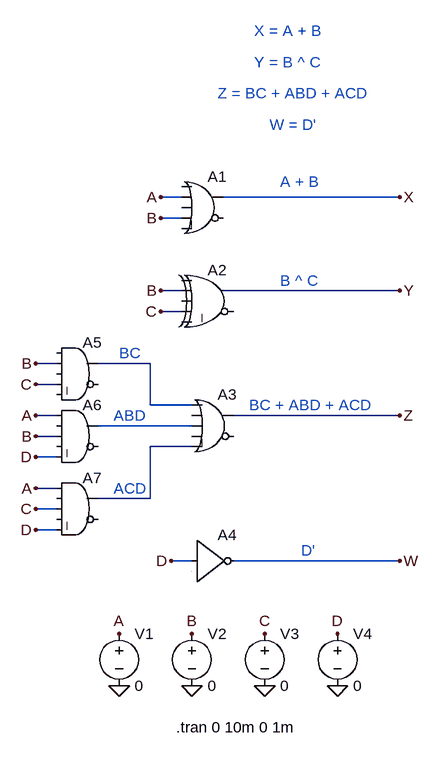
[diagram p0: schematic Exercise3.asc]
Exercise3.asc, the LTspice schematic file:
Version 4
SHEET 1 880 784
WIRE 208 -48 176 -48
WIRE 544 -48 272 -48
WIRE 208 -16 176 -16
WIRE 208 96 176 96
WIRE 544 96 272 96
WIRE 208 128 176 128
WIRE 16 208 -16 208
WIRE 160 208 80 208
WIRE 16 240 -16 240
WIRE 160 272 160 208
WIRE 224 272 160 272
WIRE 16 288 -16 288
WIRE 544 288 288 288
WIRE 224 304 80 304
WIRE 16 320 -16 320
WIRE 224 336 160 336
WIRE 16 352 -16 352
WIRE 16 400 -16 400
WIRE 160 416 160 336
WIRE 160 416 80 416
WIRE 16 432 -16 432
WIRE 16 464 -16 464
WIRE 224 512 192 512
WIRE 544 512 288 512
FLAG 112 704 0
FLAG 224 704 0
FLAG 336 704 0
FLAG 448 704 0
FLAG 112 624 A
FLAG 224 624 B
FLAG 336 624 C
FLAG 448 624 D
FLAG 176 -48 A
FLAG 176 -16 B
FLAG 176 96 B
FLAG 176 128 C
FLAG -16 208 B
FLAG -16 240 C
FLAG -16 288 A
FLAG -16 320 B
FLAG -16 352 D
FLAG -16 400 A
FLAG -16 464 D
FLAG -16 432 C
FLAG 192 512 D
FLAG 544 -48 X
FLAG 544 96 Y
FLAG 544 288 Z
FLAG 544 512 W
SYMBOL Digital\\xor 256 48 R0
SYMATTR InstName A2
SYMATTR SpiceLine vhigh=5V
SYMBOL Digital\\or 256 240 R0
SYMATTR InstName A3
SYMATTR SpiceLine vhigh=5V
SYMBOL Digital\\inv 224 448 R0
SYMATTR InstName A4
SYMATTR SpiceLine vhigh=5V
SYMBOL voltage 112 608 R0
WINDOW 123 0 0 Left 0
WINDOW 39 0 0 Left 0
SYMATTR InstName V1
SYMATTR Value 0
SYMBOL voltage 224 608 R0
WINDOW 123 0 0 Left 0
WINDOW 39 0 0 Left 0
SYMATTR InstName V2
SYMATTR Value 0
SYMBOL voltage 336 608 R0
WINDOW 123 0 0 Left 0
WINDOW 39 0 0 Left 0
SYMATTR InstName V3
SYMATTR Value 0
SYMBOL voltage 448 608 R0
WINDOW 123 0 0 Left 0
WINDOW 39 0 0 Left 0
SYMATTR InstName V4
SYMATTR Value 0
SYMBOL Digital\\and 48 160 R0
SYMATTR InstName A5
SYMATTR SpiceLine vhigh=5V
SYMBOL Digital\\and 48 256 R0
SYMATTR InstName A6
SYMATTR SpiceLine vhigh=5V
SYMBOL Digital\\and 48 368 R0
SYMATTR InstName A7
SYMATTR SpiceLine vhigh=5V
SYMBOL Digital\\or 240 -96 R0
SYMATTR InstName A1
SYMATTR SpiceLine vhigh=5V
TEXT 360 -72 Left 2 ;A + B
TEXT 360 80 Left 2 ;B ^ C
TEXT 392 496 Left 2 ;D'
TEXT 112 192 Left 2 ;BC
TEXT 104 288 Left 2 ;ABD
TEXT 104 400 Left 2 ;ACD
TEXT 312 272 Left 2 ;BC + ABD + ACD
TEXT 200 768 Left 2 !.tran 0 10m 0 1m
TEXT 320 -304 Left 2 ;X = A + B
TEXT 320 -256 Left 2 ;Y = B ^ C
TEXT 264 -208 Left 2 ;Z = BC + ABD + ACD
TEXT 344 -160 Left 2 ;W = D'

The netlist it stands for:
* Exercise3.asc
A2 0 B 0 C 0 0 Y 0 XOR vhigh=5V
A3 N001 0 N002 0 N003 0 Z 0 OR vhigh=5V
A4 D 0 0 0 0 W 0 0 BUF vhigh=5V
V1 A 0 0
V2 B 0 0
V3 C 0 0
V4 D 0 0
A5 0 B 0 C 0 0 N001 0 AND vhigh=5V
A6 A 0 B 0 D 0 N002 0 AND vhigh=5V
A7 A 0 C 0 D 0 N003 0 AND vhigh=5V
A1 0 A 0 B 0 0 X 0 OR vhigh=5V
* A + B
* B ^ C
* D'
* BC
* ABD
* ACD
* BC + ABD + ACD
.tran 0 10m 0 1m
* X = A + B
* Y = B ^ C
* Z = BC + ABD + ACD
* W = D'
.backanno
.end